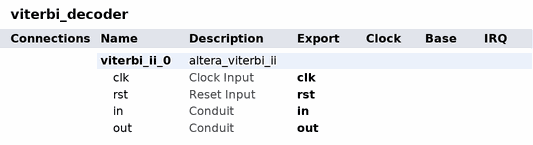
[diagram p0: system contents]
# Platform Designer (Qsys) system viterbi_decoder
# Parameters at their usual value, and those the tool derives, are not listed.
package require -exact qsys 19.1
create_system viterbi_decoder

add_instance viterbi_ii_0 altera_viterbi_ii 19.1
set_instance_property viterbi_ii_0 AUTO_EXPORT true
set_instance_parameter_value viterbi_ii_0 BSF 1
set_instance_parameter_value viterbi_ii_0 FMAX 80.0
set_instance_parameter_value viterbi_ii_0 ISBER 0
set_instance_parameter_value viterbi_ii_0 ISOCTAL Decimal
set_instance_parameter_value viterbi_ii_0 L 7
set_instance_parameter_value viterbi_ii_0 NODESYNC 0
set_instance_parameter_value viterbi_ii_0 acs_units 1
set_instance_parameter_value viterbi_ii_0 dec_mode V
set_instance_parameter_value viterbi_ii_0 design_env NATIVE
set_instance_parameter_value viterbi_ii_0 ga 91
set_instance_parameter_value viterbi_ii_0 gb 121
set_instance_parameter_value viterbi_ii_0 gc 0
set_instance_parameter_value viterbi_ii_0 gd 0
set_instance_parameter_value viterbi_ii_0 ge 0
set_instance_parameter_value viterbi_ii_0 gf 0
set_instance_parameter_value viterbi_ii_0 gg 0
set_instance_parameter_value viterbi_ii_0 n 2
set_instance_parameter_value viterbi_ii_0 ncodes 1
set_instance_parameter_value viterbi_ii_0 parallel_optimization Continuous
set_instance_parameter_value viterbi_ii_0 selected_device_family {Cyclone V}
set_instance_parameter_value viterbi_ii_0 softbits 8
set_instance_parameter_value viterbi_ii_0 v 42
set_instance_parameter_value viterbi_ii_0 viterbi_type Parallel

# exported interfaces
add_interface clk clock sink
set_interface_property clk EXPORT_OF viterbi_ii_0.clk
add_interface in conduit end
set_interface_property in EXPORT_OF viterbi_ii_0.in
add_interface out conduit end
set_interface_property out EXPORT_OF viterbi_ii_0.out
add_interface rst reset sink
set_interface_property rst EXPORT_OF viterbi_ii_0.rst

set_interconnect_requirement {$system} qsys_mm.clockCrossingAdapter HANDSHAKE
set_interconnect_requirement {$system} qsys_mm.enableEccProtection FALSE
set_interconnect_requirement {$system} qsys_mm.insertDefaultSlave FALSE
set_interconnect_requirement {$system} qsys_mm.maxAdditionalLatency 1

save_system viterbi_decoder.qsys
